# EAGLE design tankMotorDriver (EAGLE 7.2.0)
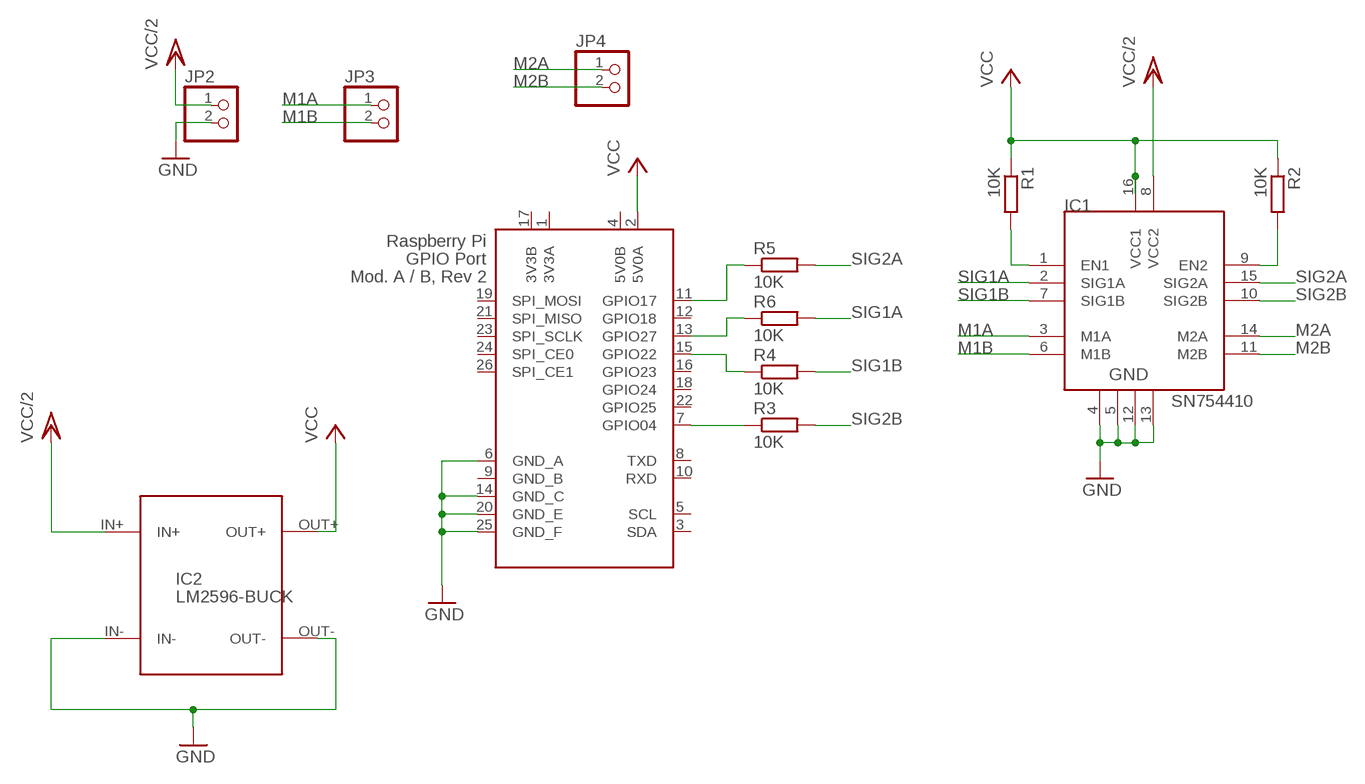
[diagram p0: schematic, sheet 1]

## Parts
IC1  SN754410  [DIP16]
IC2  LM2596-BUCK  [LM2596-BUCK]
JP2  PINHD-1X2  [1X02]
JP3  PINHD-1X2  [1X02]
JP4  PINHD-1X2  [1X02]
R1  10K  R-EU_0207/10  [0207/10]
R2  10K  R-EU_0207/10  [0207/10]
R3  10K  R-EU_0207/10  [0207/10]
R4  10K  R-EU_0207/10  [0207/10]
R5  10K  R-EU_0207/10  [0207/10]
R6  10K  R-EU_0207/10  [0207/10]
X1  RASPI_GPIO_AB#_PIN  [RASPI_GPIO_AB_PIN]

## Nets
GND: IC1.4 IC1.5 IC1.12 IC1.13 IC2.IN- IC2.OUT- JP2.2 X1.6(GND_A) X1.14(GND_C) X1.20(GND_E) X1.25(GND_F)
M1A: IC1.3(M1A) JP3.1
M1B: IC1.6(M1B) JP3.2
M2A: IC1.14(M2A) JP4.1
M2B: IC1.11(M2B) JP4.2
N$1: IC1.1(EN1) R1.2
N$2: IC1.9(EN2) R2.2
N$3: R3.1 X1.7(GPIO04)
N$4: R5.1 X1.11(GPIO17)
N$5: R6.1 X1.13(GPIO27)
N$6: R4.1 X1.15(GPIO22)
SIG1A: IC1.2(SIG1A) R6.2
SIG1B: IC1.7(SIG1B) R4.2
SIG2A: IC1.15(SIG2A) R5.2
SIG2B: IC1.10(SIG2B) R3.2
VCC: IC1.16(VCC1) IC2.OUT+ R1.1 R2.1 X1.2(5V0A)
VCC/2: IC1.8(VCC2) IC2.IN+ JP2.1
Unconnected: X1.3(SDA) X1.5(SCL) X1.8(TXD) X1.10(RXD) X1.12(GPIO18) X1.16(GPIO23) X1.18(GPIO24) X1.19(SPI_MOSI) X1.21(SPI_MISO) X1.22(GPIO25) X1.23(SPI_SCLK) X1.24(SPI_CE0) X1.26(SPI_CE1)

## Power pins joined to a net without a drawn wire
3V3A: X1.1(3V3A)
3V3B: X1.17(3V3B)
5V0B: X1.4(5V0B)
GND_B: X1.9(GND_B)

## Library data of the parts
IC1 = HBridge:SN754410: Quadruple half-H driver
IC2 = buck_lm2596_dc_dc:LM2596-BUCK
JP2-JP4 = pinhead:PINHD-1X2: PIN HEADER
R1-R6 = resistor:R-EU_: RESISTOR, European symbol
X1 = raspberrypi_bastelstube_v13:RASPI_GPIO_AB#: 2x13 header connector, all pins connected

## Board
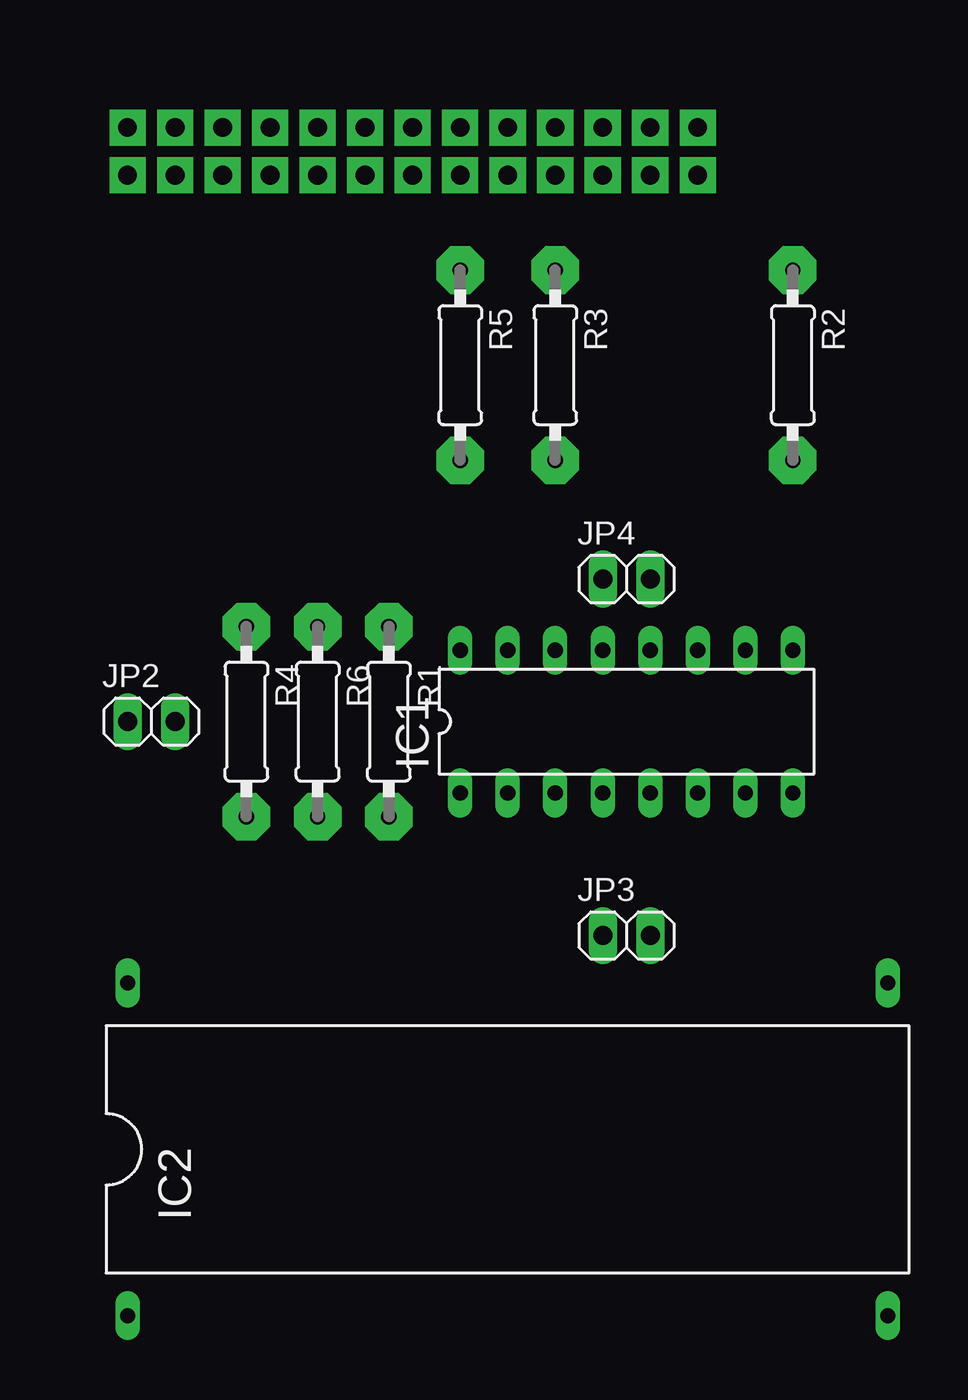
[diagram p1: board, top side]
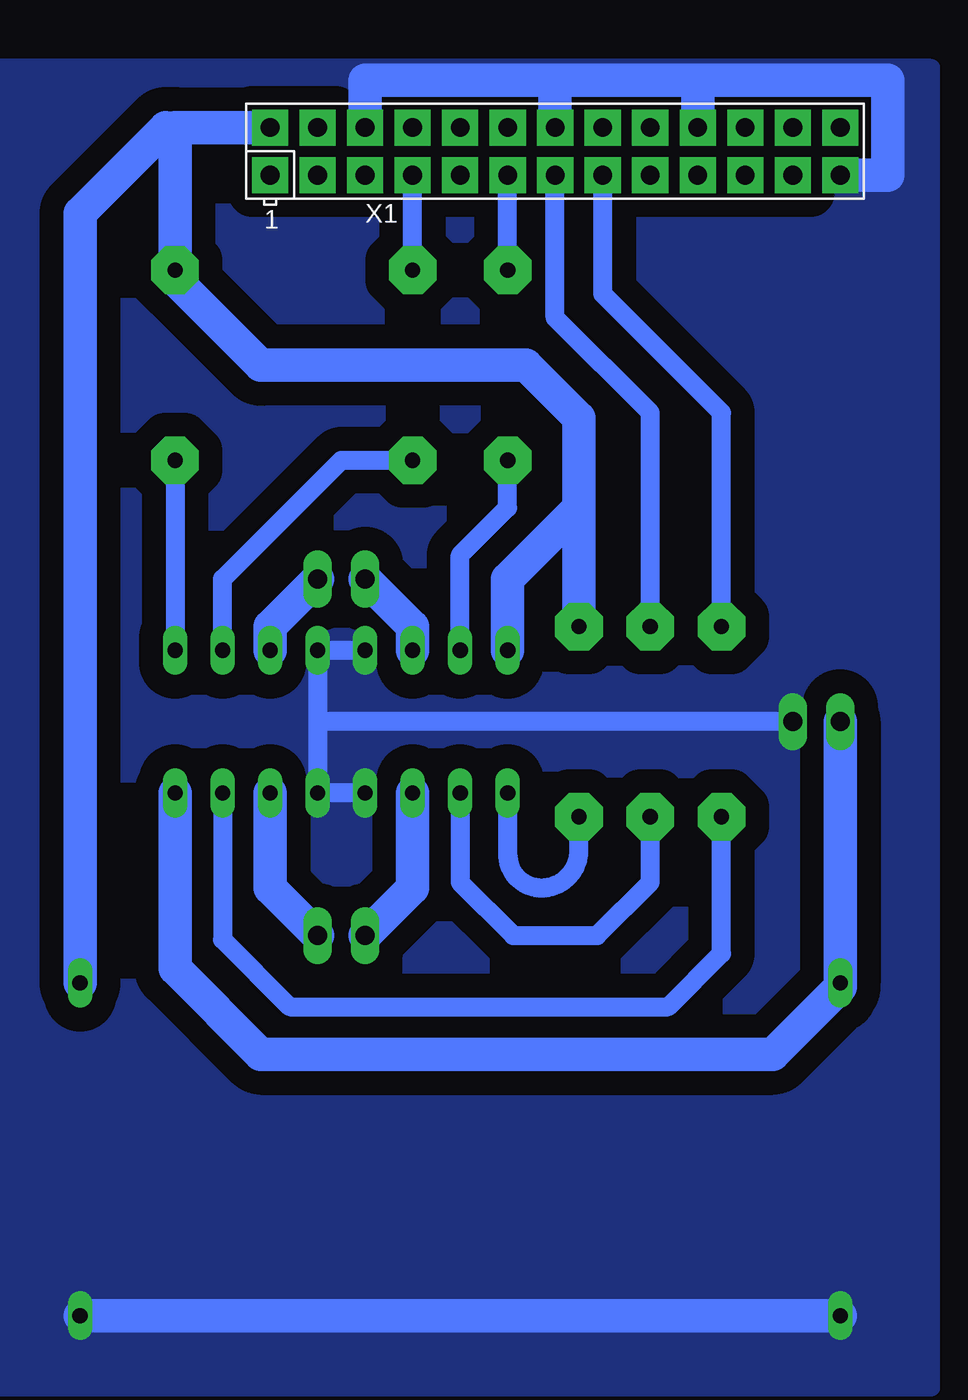
[diagram p2: board, bottom side, seen from below]

No outline drawn. Coordinates in mm, seen from the top.
Copper layers (1*16): Top 0.035mm / dielectric 1.5mm / Bottom 0.035mm
Design rules "default *": minimum track width 1mm, minimum drill 1.5mm, track to track 12mil, track to pad 12mil, pad to pad 12mil, via to via 12mil, smd to smd 8mil, copper to edge 40mil, drill to drill 8mil, minimum pad ring 10mil, minimum via ring 10mil, stop-mask expansion 4mil, vias tented up to drill 0mil, thermal gap 10mil

### Footprints (pad centres in the part's own frame; a part is rotated, then mirrored left to right if it is on the bottom)
DIP16 = drill 0.813 long: 1 -10.16,-3.81; 2 -7.62,-3.81; 3 -5.08,-3.81; 4 -2.54,-3.81; 5 0,-3.81; 6 2.54,-3.81; 7 5.08,-3.81; 8 7.62,-3.81; 9 7.62,3.81; 10 5.08,3.81; 11 2.54,3.81; 12 0,3.81; 13 -2.54,3.81; 14 -5.08,3.81; 15 -7.62,3.81; 16 -10.16,3.81
LM2596-BUCK = drill 0.813 long: IN+ -22.86,8.89; IN- -22.86,-8.89; OUT+ 17.78,8.89; OUT- 17.78,-8.89
1X02 = drill 1.016 long: 1 -1.27,0; 2 1.27,0
0207/10 = drill 0.813 pad 2.54 octagon: 1 -5.08,0; 2 5.08,0
RASPI_GPIO_AB_PIN = drill 1 pad 1.93 square: 1 -15.24,-1.27; 2 -15.24,1.27; 3 -12.7,-1.27; 4 -12.7,1.27; 5 -10.16,-1.27; 6 -10.16,1.27; 7 -7.62,-1.27; 8 -7.62,1.27; 9 -5.08,-1.27; 10 -5.08,1.27; 11 -2.54,-1.27; 12 -2.54,1.27; 13 0,-1.27; 14 0,1.27; 15 2.54,-1.27; 16 2.54,1.27; 17 5.08,-1.27; 18 5.08,1.27; 19 7.62,-1.27; 20 7.62,1.27; 21 10.16,-1.27; 22 10.16,1.27; 23 12.7,-1.27; 24 12.7,1.27; 25 15.24,-1.27; 26 15.24,1.27

### Placement (x,y rotation side)
IC1  33.02,38.1 0 top
IC2  27.94,15.24 0 top
JP2  6.35,38.1 0 top
JP3  31.75,26.67 0 top
JP4  31.75,45.72 0 top
R1  19.05,38.1 270 top
R2  40.64,57.15 270 top
R3  27.94,57.15 270 top
R4  11.43,38.1 270 top
R5  22.86,57.15 270 top
R6  15.24,38.1 270 top
X1  20.32,68.58 0 bottom

### Tracks (layer width: path | path; a pad name or v marks a point on that pad's centre or on a via)
GND
  Bottom 1.016: IC1.4 IC1.5 33.02,38.1 | IC1.13 IC1.12 33.02,38.1 | JP2.2 33.02,38.1
  Bottom 1.778: IC2.OUT- IC2.IN- | X1.6 30.48,72.39 20.32,72.39 | 20.32,72.39 12.7,72.39 | 12.7,72.39 2.54,72.39 2.54,67.31 X1.25 | X1.14 20.32,72.39 | X1.20 12.7,72.39
  pour Bottom (isolate 1.27, no thermals): 0.24,2.54 0.24,73.01 51.34,73.01 51.34,2.54
M1A
  Bottom 1.778: IC1.3 27.94,29.21 JP3.1
M1B
  Bottom 1.778: IC1.6 35.56,29.21 JP3.2
M2A
  Bottom 1.778: IC1.14 27.94,43.18 JP4.1
M2B
  Bottom 1.778: IC1.11 35.56,43.18 JP4.2
N$1
  Bottom 1.016: IC1.1 22.86,31.01 arc-90 21.06,29.21 arc-90 19.05,31.22 R1.2
N$2
  Bottom 1.016: R2.2 IC1.9
N$3
  Bottom 1.016: R3.1 X1.7
N$4
  Bottom 1.016: R5.1 X1.11
N$5
  Bottom 1.016: R6.1 15.24,54.61 20.32,59.69 X1.13
N$6
  Bottom 1.016: R4.1 11.43,54.61 17.78,60.96 X1.15
SIG1A
  Bottom 1.016: IC1.2 25.4,29.51 22.56,26.67 18.08,26.67 15.24,29.51 R6.2
SIG1B
  Bottom 1.016: IC1.7 38.1,26.45 34.51,22.86 14.27,22.86 11.43,25.7 R4.2
SIG2A
  Bottom 1.016: IC1.15 25.4,46.99 22.86,49.53 R5.2
SIG2B
  Bottom 1.016: IC1.10 38.1,45.72 31.75,52.07 R3.2
VCC
  Bottom 1.016: 41.14,69.85 40.64,69.85
  Bottom 1.778: R1.1 19.05,49.53 | 19.05,49.53 19.05,54.31 21.89,57.15 36.06,57.15 40.64,61.73 R2.1 40.64,69.85 X1.2 | IC2.OUT+ 45.72,65.27 41.14,69.85 | IC1.16 22.86,45.72 19.05,49.53
VCC/2
  Bottom 1.016: 5.08,23.91 IC2.IN+
  Bottom 1.778: JP2.1 IC2.IN+ | IC1.8 40.64,24.9 36.06,20.32 8.67,20.32 5.08,23.91